# EAGLE schematic Version_1 (EAGLE 6.3)
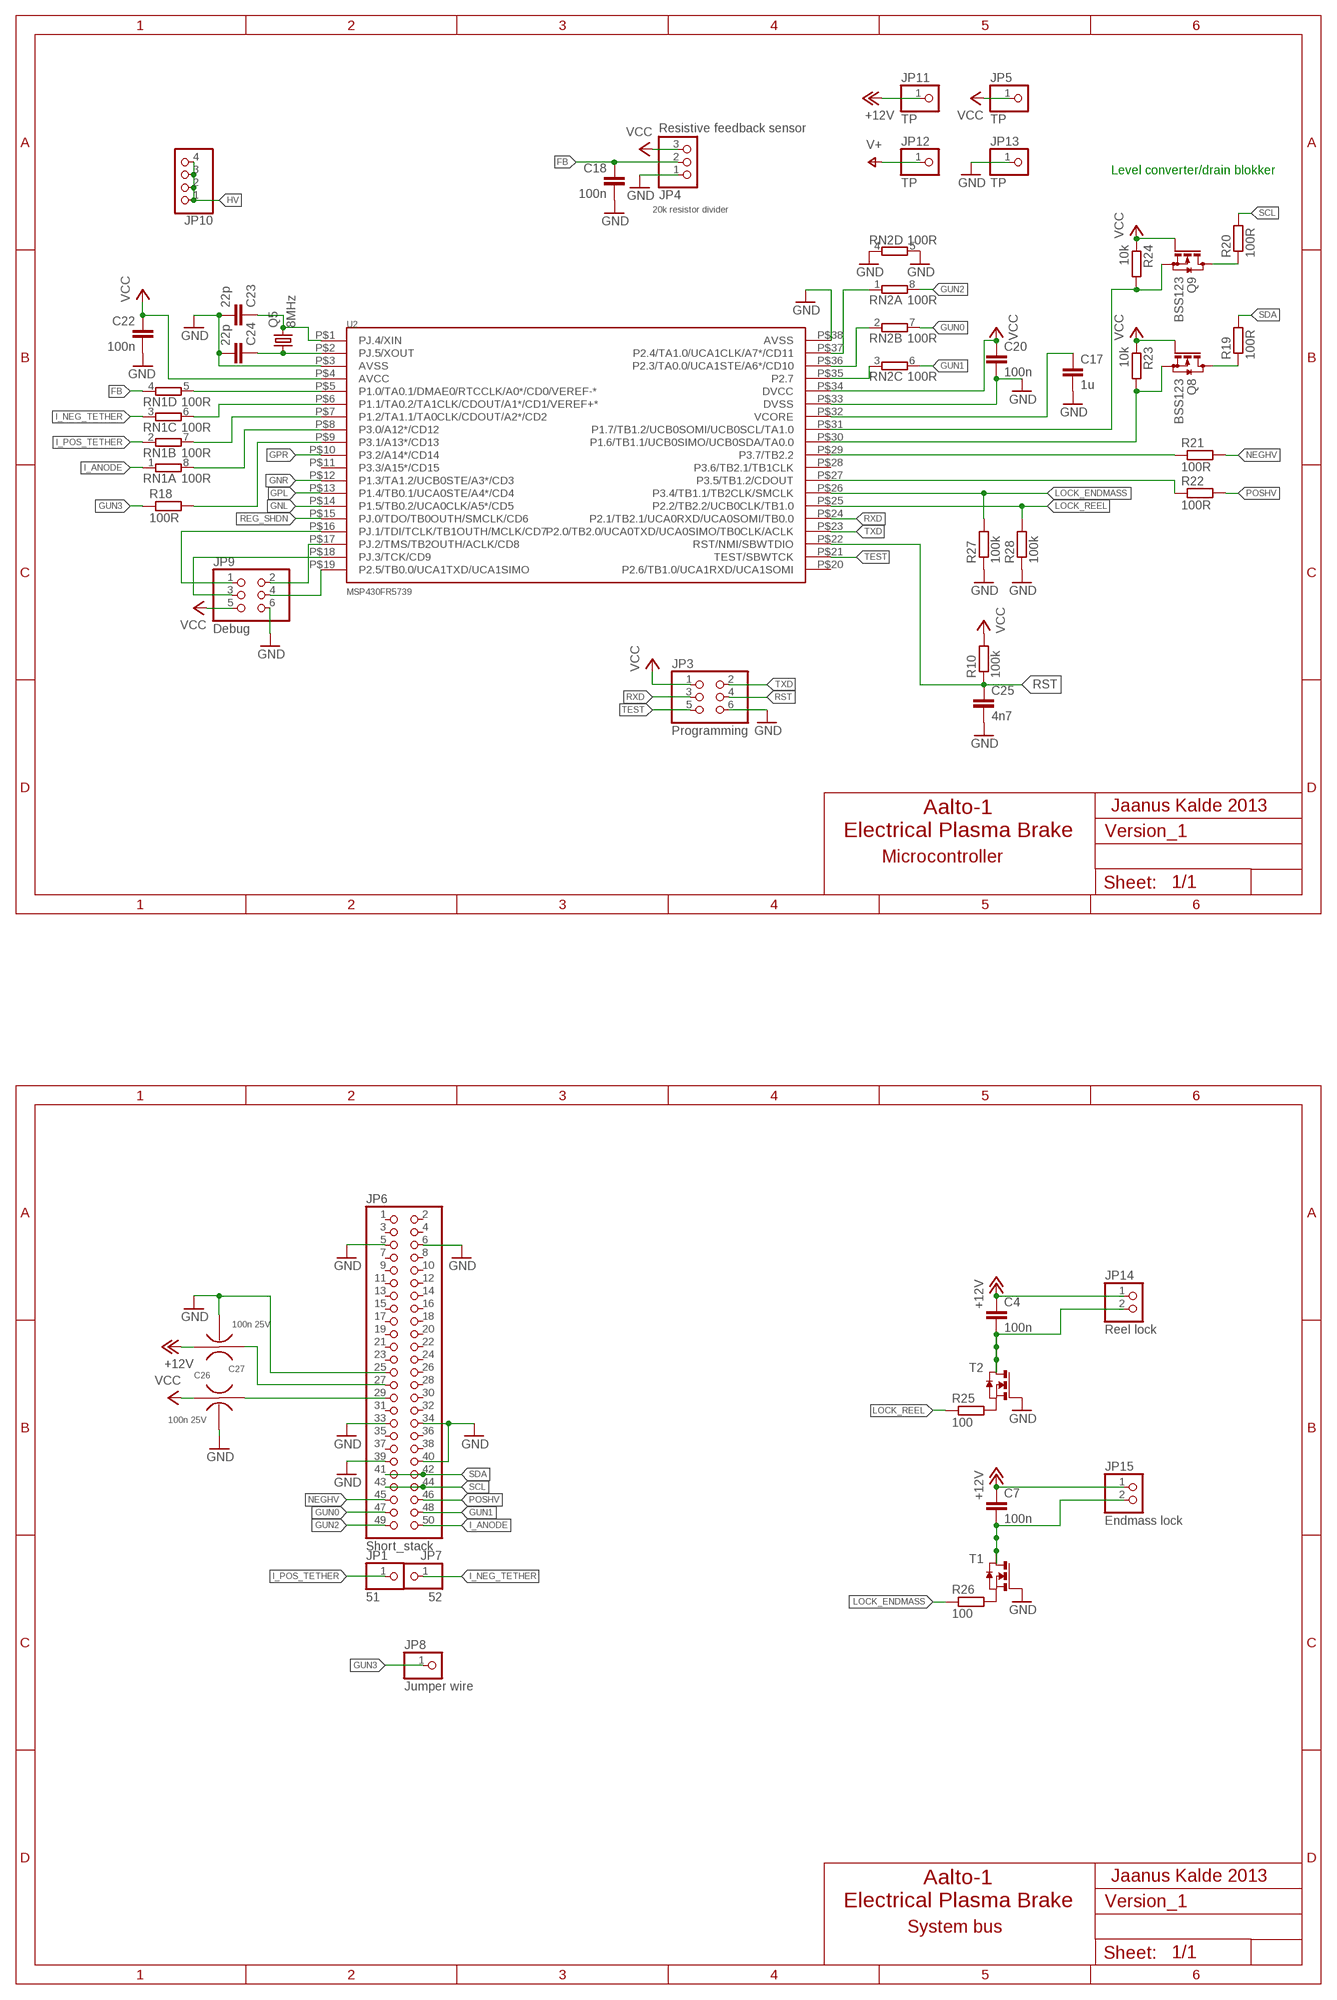
[diagram p0: schematic, sheet 1, part 1 of 2]
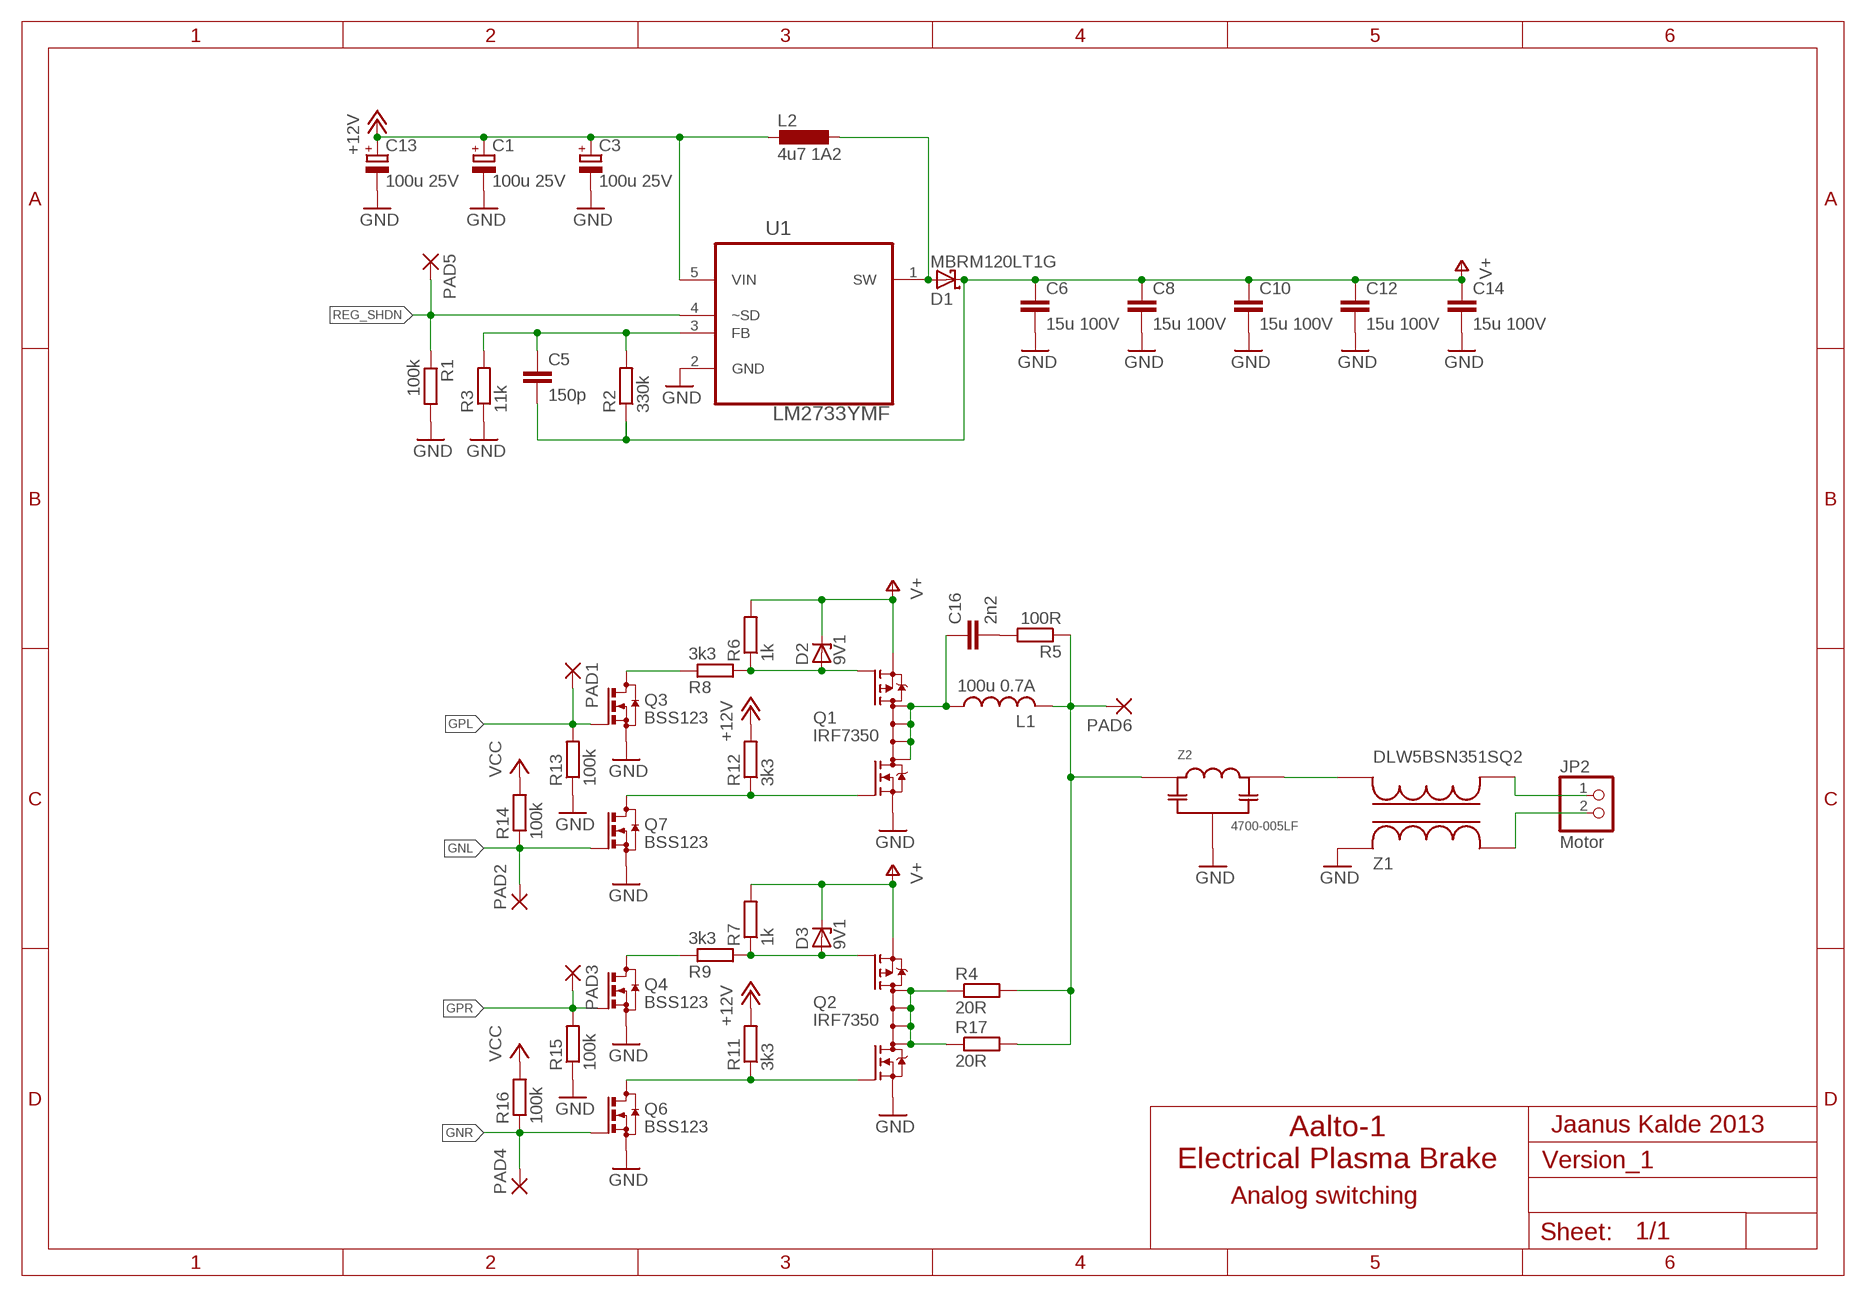
[diagram p1: schematic, sheet 1, part 2 of 2]

## Parts
C1  100u 25V  CPOL-EUSMCE  [SMC_E]
C3  100u 25V  CPOL-EUSMCE  [SMC_E]
C4  100n  C-EUC0603  [C0603]
C5  150p  C-EUC0603K  [C0603K]
C6  15u 100V  C-EUC2220K  [C2220K]
C7  100n  C-EUC0603  [C0603]
C8  15u 100V  C-EUC2220K  [C2220K]
C10  15u 100V  C-EUC2220K  [C2220K]
C12  15u 100V  C-EUC2220K  [C2220K]
C13  100u 25V  CPOL-EUSMCE  [SMC_E]
C14  15u 100V  C-EUC2220K  [C2220K]
C16  2n2  C-EUC0805  [C0805]
C17  1u  C-EUC0603K  [C0603K]
C18  100n  C-EUC0603K  [C0603K]
C20  100n  C-EUC0603K  [C0603K]
C22  100n  C-EUC0603  [C0603]
C23  22p  C-EUC0603  [C0603]
C24  22p  C-EUC0603  [C0603]
C25  4n7  C-EUC0603  [C0603]
C26  100n 25V  CAP-3TERM  [0805-3TERM]
C27  100n 25V  CAP-3TERM  [0805-3TERM]
D1  MBRM120LT1G  [POWERMITE]
D2  9V1  ZENER-DIODESOD80C  [SOD80C]
D3  9V1  ZENER-DIODESOD80C  [SOD80C]
JP1  51  PINHD-1X1  [1X01]
JP2  Motor  PINHD-1X02_2.00  [1X02M]
JP3  Programming  PINHD-2X03_MICROMATCH  [MICROMATCH-6]
JP4  Resistive feedback sensor  PINHD-1X03_2.00  [1X03M]
JP5  TP  PINHD-1X1  [1X01]
JP6  Short_stack  PINHD-2X25  [2X25]
JP7  52  PINHD-1X1  [1X01]
JP8  Jumper wire  PINHD-1X1  [1X01]
JP9  Debug  PINHD-2X03_MICROMATCH  [MICROMATCH-6]
JP10  PINHD-1X4  [1X04]
JP11  TP  PINHD-1X1  [1X01]
JP12  TP  PINHD-1X1  [1X01]
JP13  TP  PINHD-1X1  [1X01]
JP14  Reel lock  PINHD-1X02_2.00  [1X02M]
JP15  Endmass lock  PINHD-1X02_2.00  [1X02M]
L1  100u 0.7A  L-SMD-7.3  [L-SMD-7.3]
L2  4u7 1A2  SRR4011  [SRR4011]
PAD1  WIREPAD1,6/0,8  [1,6/0,8]
PAD2  WIREPAD1,6/0,8  [1,6/0,8]
PAD3  WIREPAD1,6/0,8  [1,6/0,8]
PAD4  WIREPAD1,6/0,8  [1,6/0,8]
PAD5  WIREPAD1,6/0,8  [1,6/0,8]
PAD6  WIREPAD1,6/0,8  [1,6/0,8]
Q1  IRF7350  IRF7389  [SO08-IRF]
Q2  IRF7350  IRF7389  [SO08-IRF]
Q3  BSS123  [SOT23]
Q4  BSS123  [SOT23]
Q5  8MHz  CRYSTALHC49UV  [HC49U-V]
Q6  BSS123  [SOT23]
Q7  BSS123  [SOT23]
Q8  BSS123  [SOT23]
Q9  BSS123  [SOT23]
R1  100k  R-EU_R0603  [R0603]
R2  330k  R-EU_R0603  [R0603]
R3  11k  R-EU_R0603  [R0603]
R4  20R  R-EU_R2512  [R2512]
R5  100R  R-EU_R0805  [R0805]
R6  1k  R-EU_R0805  [R0805]
R7  1k  R-EU_R0805  [R0805]
R8  3k3  R-EU_R0805  [R0805]
R9  3k3  R-EU_R0805  [R0805]
R10  100k  R-EU_R0603  [R0603]
R11  3k3  R-EU_R0805  [R0805]
R12  3k3  R-EU_R0805  [R0805]
R13  100k  R-EU_R0603  [R0603]
R14  100k  R-EU_R0603  [R0603]
R15  100k  R-EU_R0603  [R0603]
R16  100k  R-EU_R0603  [R0603]
R17  20R  R-EU_R2512  [R2512]
R18  100R  R-EU_R0603  [R0603]
R19  100R  R-EU_R0603  [R0603]
R20  100R  R-EU_R0603  [R0603]
R21  100R  R-EU_R0603  [R0603]
R22  100R  R-EU_R0603  [R0603]
R23  10k  R-EU_R0603  [R0603]
R24  10k  R-EU_R0603  [R0603]
R25  100  R-EU_R0603  [R0603]
R26  100  R-EU_R0603  [R0603]
R27  100k  R-EU_R0603  [R0603]
R28  100k  R-EU_R0603  [R0603]
RN1  100R  4R-NEXBN8V  [EXBN8V]
RN2  100R  4R-NEXBN8V  [EXBN8V]
T1  NMOSSOT23-6  [SOT23-6]
T2  NMOSSOT23-6  [SOT23-6]
U1  LM2733YMF  [SOT95P284X119-5N]
U2  MSP430FR5739  [TSSOP38]
Z1  DLW5BSN351SQ2  DLW5BS  [DLW5BS]
Z2  4700-005LF  FILTER-PI  [FILTER-PI]

## Nets
+12V: C1.+ C3.+ C4.1 C7.1 C13.+ C26.P$1 JP11.1 JP14.1 JP15.1 L2.P$1 R11.2 R12.2 U1.5(VIN)
CLK: JP9.3 U2.P$18(PJ.3/TCK/CD9)
FB: C18.1 JP4.2 RN1.4
FBBBBBA: C5.1 R2.2 R3.2 U1.3(FB)
GND: C1.- C3.- C6.2 C8.2 C10.2 C12.2 C13.- C14.2 C17.2 C18.2 C20.2 C22.2 C23.2 C24.2 C25.2 C26.P$2 C27.P$2 JP3.6 JP4.1 JP6.5 JP6.6 JP6.25 JP6.33 JP6.34 JP6.39 JP6.40 JP9.6 JP13.1 Q1.1(N-S) Q2.1(N-S) Q3.2(S) Q4.2(S) Q6.2(S) Q7.2(S) R1.2 R3.1 R13.1 R15.1 R27.1 R28.1 RN2.4 RN2.5 T1.4(G) T2.4(G) U1.2(GND) U2.P$3(AVSS) U2.P$33(DVSS) U2.P$38(AVSS) Z1.P$2 Z2.P$2
GNL: PAD2.1(P) Q7.1(G) R14.1 U2.P$14(P1.5/TB0.2/UCA0CLK/A5*/CD5)
GNR: PAD4.1(P) Q6.1(G) R16.1 U2.P$12(P1.3/TA1.2/UCB0STE/A3*/CD3)
GPL: PAD1.1(P) Q3.1(G) R13.2 U2.P$13(P1.4/TB0.1/UCA0STE/A4*/CD4)
GPR: PAD3.1(P) Q4.1(G) R15.2 U2.P$10(P3.2/A14*/CD14)
GUN0: JP6.47 RN2.7
GUN1: JP6.48 RN2.6
GUN2: JP6.49 RN2.8
GUN3: JP8.1 R18.1
HV: JP10.1 JP10.2 JP10.3 JP10.4
I_ANODE: JP6.50 RN1.1
I_NEG_TETHER: JP7.1 RN1.3
I_POS_TETHER: JP1.1 RN1.2
LOCK_ENDMASS: R26.1 R27.2 U2.P$26(P3.4/TB1.1/TB2CLK/SMCLK)
LOCK_REEL: R25.1 R28.2 U2.P$25(P2.2/TB2.2/UCB0CLK/TB1.0)
MISO/RX: JP9.2 U2.P$17(PJ.2/TMS/TB2OUTH/ACLK/CD8)
N$1: Q2.2(N-G) Q6.3(D) R11.1
N$2: C7.2 JP15.2 T1.1(D) T1.2(D1) T1.5(D2) T1.6(D3)
N$3: R26.2 T1.3(S)
N$4: C17.1 U2.P$32(VCORE)
N$5: RN1.5 U2.P$5(P1.0/TA0.1/DMAE0/RTCCLK/A0*/CD0/VEREF-*)
N$6: Q1.2(N-G) Q7.3(D) R12.1
N$7: C26.P$3 JP6.27
N$8: D1.2(A) L2.P$2 U1.1(SW)
N$9: C4.2 JP14.2 T2.1(D) T2.2(D1) T2.5(D2) T2.6(D3)
N$10: R25.2 T2.3(S)
N$11: Q9.3(D) R20.1
N$12: Q8.3(D) R19.1
N$14: C16.2 R5.2
N$15: C16.1 L1.P$1 Q1.5(D) Q1.6(D) Q1.7(D) Q1.8(D)
N$16: L1.P$2 PAD6.1(P) R4.2 R5.1 R17.2 Z2.P$1
N$17: Q2.5(D) Q2.6(D) Q2.7(D) Q2.8(D) R4.1 R17.1
N$18: C27.P$1 JP6.29
N$19: Q9.2(S) R24.2 U2.P$31(P1.7/TB1.2/UCB0SOMI/UCB0SCL/TA1.0)
N$20: D2.A Q1.4(P-G) R6.1 R8.2
N$21: Z1.P$3 Z2.P$3
N$22: D3.A Q2.4(P-G) R7.1 R9.2
N$23: JP2.1 Z1.P$4
N$24: Q3.3(D) R8.1
N$25: Q4.3(D) R9.1
N$27: R22.1 U2.P$27(P3.5/TB1.2/CDOUT)
N$28: C23.1 Q5.2 U2.P$1(PJ.4/XIN)
N$29: C24.1 Q5.1 U2.P$2(PJ.5/XOUT)
N$30: RN1.6 U2.P$6(P1.1/TA0.2/TA1CLK/CDOUT/A1*/CD1/VEREF+*)
N$31: RN2.1 U2.P$37(P2.4/TA1.0/UCA1CLK/A7*/CD11)
N$32: R21.1 U2.P$29(P3.7/TB2.2)
N$33: Q8.2(S) R23.2 U2.P$30(P1.6/TB1.1/UCB0SIMO/UCB0SDA/TA0.0)
N$34: RN1.7 U2.P$7(P1.2/TA1.1/TA0CLK/CDOUT/A2*/CD2)
N$35: JP2.2 Z1.P$1
N$36: RN1.8 U2.P$8(P3.0/A12*/CD12)
N$38: RN2.2 U2.P$36(P2.3/TA0.0/UCA1STE/A6*/CD10)
N$39: RN2.3 U2.P$35(P2.7)
N$40: R18.2 U2.P$9(P3.1/A13*/CD13)
N$41: JP9.1 U2.P$16(PJ.1/TDI/TCLK/TB1OUTH/MCLK/CD7)
NEGHV: JP6.45 R21.2
POSHV: JP6.46 R22.2
REG_SHDN: PAD5.1(P) R1.1 U1.4(~SD) U2.P$15(PJ.0/TDO/TB0OUTH/SMCLK/CD6)
RST: C25.1 JP3.4 R10.1 U2.P$22(RST/NMI/SBWTDIO)
RXD: JP3.3 U2.P$24(P2.1/TB2.1/UCA0RXD/UCA0SOMI/TB0.0)
SCL: JP6.43 JP6.44 R20.2
SDA: JP6.41 JP6.42 R19.2
SLAVE: JP9.4 U2.P$19(P2.5/TB0.0/UCA1TXD/UCA1SIMO)
TEST: JP3.5 U2.P$21(TEST/SBWTCK)
TXD: JP3.2 U2.P$23(P2.0/TB2.0/UCA0TXD/UCA0SIMO/TB0CLK/ACLK)
V+: C5.2 C6.1 C8.1 C10.1 C12.1 C14.1 D1.1(C) D2.C D3.C JP12.1 Q1.3(P-S) Q2.3(P-S) R2.1 R6.2 R7.2
VCC: C20.1 C22.1 C27.P$3 JP3.1 JP4.3 JP5.1 JP9.5 Q8.1(G) Q9.1(G) R10.2 R14.2 R16.2 R23.1 R24.1 U2.P$4(AVCC) U2.P$34(DVCC)
Unconnected: JP6.1 JP6.2 JP6.3 JP6.4 JP6.7 JP6.8 JP6.9 JP6.10 JP6.11 JP6.12 JP6.13 JP6.14 JP6.15 JP6.16 JP6.17 JP6.18 JP6.19 JP6.20 JP6.21 JP6.22 JP6.23 JP6.24 JP6.26 JP6.28 JP6.30 JP6.31 JP6.32 JP6.35 JP6.36 JP6.37 JP6.38 U2.P$11(P3.3/A15*/CD15) U2.P$20(P2.6/TB1.0/UCA1RXD/UCA1SOMI) U2.P$28(P3.6/TB2.1/TB1CLK)

## Notes on the sheet
- Level converter/drain blokker
- 20k resistor divider
- Jaanus Kalde 2013 | Jaanus Kalde 2013
- Aalto-1
  Electrical Plasma Brake
- Aalto-1
  Electrical Plasma Brake
- Microcontroller | Analog switching
- Jaanus Kalde 2013
- Aalto-1
  Electrical Plasma Brake
- System bus

## Library data of the parts
C1 C3 C13 = rcl:CPOL-EU: POLARIZED CAPACITOR, European symbol
C4-C8 C10 C12 C14 C16-C18 C20 C22-C25 = rcl:C-EU: CAPACITOR, European symbol
C26 C27 = EC1_PL_MOTOR:CAP-3TERM
D1 = EC1_B_EPS_PARTS:MBRM120LT1G: Low capacitance Schottky diode. Recommeended in LTC3440 application.
D2 D3 = diode:ZENER-DIODE: Z-Diode
JP1 JP5 JP7 JP8 JP11-JP13 = pinhead:PINHD-1X1: PIN HEADER
JP2 JP14 JP15 = pinhead:PINHD-1X02: PIN HEADER
JP3 JP9 = pinhead:PINHD-2X03: PIN HEADER
JP4 = pinhead:PINHD-1X03: PIN HEADER
JP6 = pinhead:PINHD-2X25: PIN HEADER
JP10 = pinhead:PINHD-1X4: PIN HEADER
L1 = EC1_B_EPS_PARTS:L-SMD-7.3
L2 = EC1_PL_MOTOR:SRR4011
PAD1-PAD6 = wirepad:WIREPAD: Wire PAD connect wire on PCB
Q1 Q2 = transistor-fet:IRF7389: Complimentary Half Bridge HEXFET Power MOSFET Source: http://www.irf.com/product-info/datasheets/data/irf7389.pdf
Q3 Q4 Q6-Q9 = transistor-small-signal:BSS123: N-CHANNEL MOS FET
Q5 = SparkFun:CRYSTAL: Crystals Various standard crystals. Proven footprints. Spark Fun Electronics SKU : COM-00534
R1-R28 = rcl:R-EU_: RESISTOR, European symbol
RN1 RN2 = resistor-dil:4R-N: Array Chip Resistor Source: RS Component / Phycomp; OC_FARNELL: unknown; OC_NEWARK: unknown
T1 T2 = zetex:NMOSSOT23-6: MOS FET; OC_FARNELL: unknown; OC_NEWARK: unknown
U1 = national-semiconductor:LM2733YMF: Boost Converters; MPN: LM2733YMF; OC_FARNELL: 8181675; OC_NEWARK: 26H4075; PACKAGE: SOT-23-5; SUPPLIER: NationalSemiconductor
U2 = EC1_PL_MOTOR:MSP430FR5739
Z1 = EC1_PL_MOTOR:DLW5BS
Z2 = EC1_PL_MOTOR:FILTER-PI